# Altium schematic sheet Sheet_3.SchDoc: R2C2 - RepRapCncController
size A3; CompanyName: bitBOX; DrawnBy: FMendes75@gmail.com; Revision: V1.2; SheetNumber: 3; SheetTotal: 3; PageSetup: Record=PageOptions|CenterHorizontal=True|CenterVertical=True|PrintScale=1.04|XCorrection=1.00|YCorrection=1.00|PrintKind=1|BorderSize=5000000|LeftOffset=0|BottomOffset=0|Orientation=2|PaperLength=1000|PaperWidth=1000|Scale=100|PaperSource=7|PrintQuality=-4|MediaType=1|DitherType=10|PaperKind=A3|PrintScaleMode=1; license: Creative Commons BY-NC-SA; Site: www.3dprinting-r2c2.com; ProjectName: R2C2 - RepRapCncController
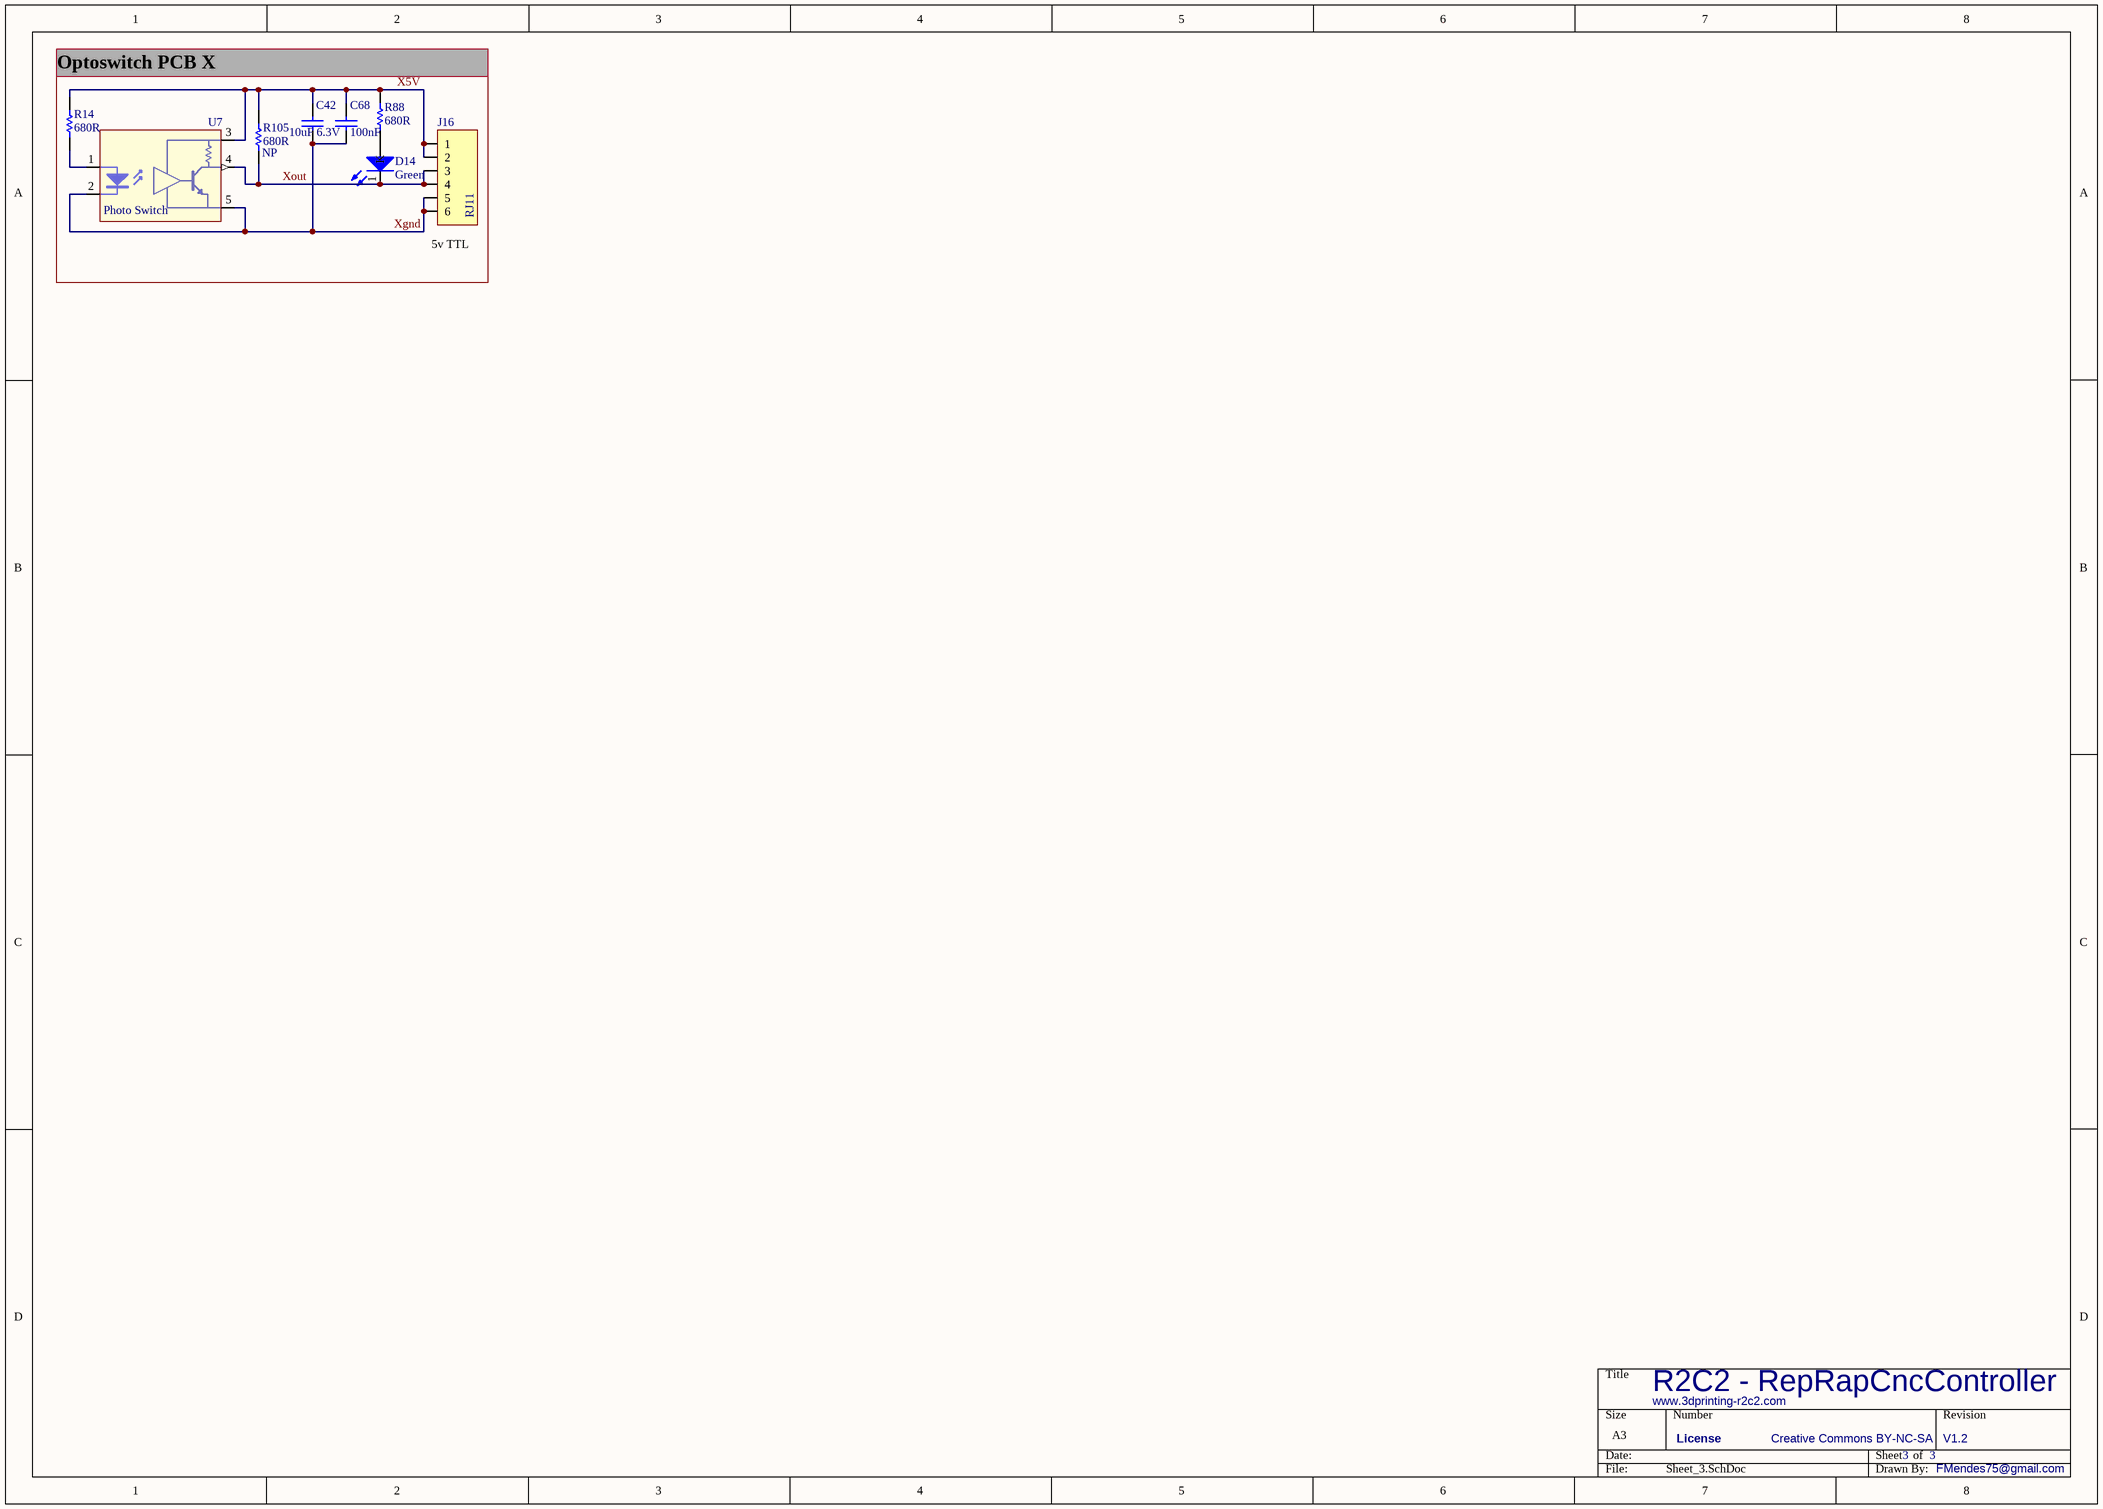
[diagram p0: Sheet_3.SchDoc]

## Parts
C42  10uF 6.3V  [CAPC2012M]
C68  100nF  [CAPC1608M]
D14  Green  [LEDM_3216X12M]
J16  RJ11  [MOLEX_95022-2667]
R14  680R  [RESC1608M]
R88  680R  [RESC1608M]
R105  680R  Populate: NP  [RESC1608M]
U7  Photo Switch  [OPIC_122x50x10]

## Nets
X5V: C42.2 C68.2 J16.1 J16.2 R14.2 R88.2 R105.2 U7.3(Vcc)
Xgnd: C42.1 C68.1 J16.5 J16.6 U7.2(K) U7.5(GND)
Xout: D14.1(K) J16.3 J16.4 R105.1 U7.4(Out)
NetD14_2: D14.2(A) R88.1
NetR14_1: R14.1 U7.1(A)

## Notes on the sheet
- Optoswitch PCB X
- (near J16) 5v TTL
- License

## Library data of the parts
C42 = 10000001: Capacitor - MLCC; 0805; Y5V; 10UF; 6.3V; Manufacturer: MULTICOMP; Type: smd; Designator: C; Man PN: MCCA000268; Pack: 0805; Distri Price1: 0,039; Distri Qty1: 100; Part Number: 10000001; Value: 10uF 6.3V; Pin Count: 2; Distri Link1: http://pt.farnell.com/multicomp/mcca000268/mlcc-08055v-6-3v-10uf/dp/1759136; Stock: 0; Component Type: Standard; Verified: 17-01-2011
C68 = 10000054: Capacitor - MLCC; 0603; NP0; 50V; Manufacturer: Multicomp; Type: smd; Designator: C; Man PN: MCCA000255; Pack: 0603; Distri Price1: 0,008; Distri Qty1: 100; Part Number: 10000054; Value: 100nF; Pin Count: 2; Distri Link1: http://pt.farnell.com/multicomp/mcca000255/mlcc-0603-x7r-50v-100nf/dp/1759122; Component Type: Standard
D14 = 10000008: Led - 1206; Green OSRAM; Type: smd; Designator: D; Man PN: LGQ971; Pack: 1206; Distri Price1: 0,063; Distri Qty1: 100; Part Number: 10000008; Manufacturer: OSRAM; Value: Green; Pin Count: 2; Distri Link1: http://pt.farnell.com/osram/lgq971/led-smd-green/dp/1226372; Stock: 0; Component Type: Standard
J16 = 10000062: Connector - PCB; RJ11; 6/4 Low Profile; Hor.; Manufacturer: Molex; Designator: J; Man PN: 95501-2641; Distri Qty1: 100; Distri Price1: 0,51; Distri Price2: 0,479; Part Number: 10000062; Type: THD; Value: RJ11; Pin Count: 6; Distri Link1: http://pt.farnell.com/molex/95501-2641/jack-6-4-low-profile/dp/1560166; Component Type: Standard; Distri Link2: http://search.digikey.com/scripts/DkSearch/dksus.dll?Detail&name=380-1018-ND; Distri Qty2: 100
R14 R88 R105 = 10000061: Resistor - 0603; 0.063W; 1%; Manufacturer: Multicomp; Designator: R; Man PN: MC 0.063W 0603 1% 680R; Pack: 0603; Distri Price1: 0,016; Distri Qty1: 100; Distri Price2: 0,006; Part Number: 10000061; Type: smd; Value: 680R; Pin Count: 2; Distri Link1: http://pt.farnell.com/multicomp/mc-0-063w-0603-5-680r/resistor-0603-680r/dp/9332251; Distri Link2: http://pt.farnell.com/multicomp/mc-0-063w-0603-5-680r/resistor-0603-680r/dp/9332251; Distri Qty2: 100; Component Type: Standard
U7 = 10000075: Opto - Switch; OPIC Sharp; Slotted 3mm; Vcc 5v; Designator: U; Man PN: GP1A53HRJ00F; Distri Price1: 1,94; Distri Qty1: 1; Part Number: 10000075; Type: THD; Manufacturer: Sharp; Value: -; Pack: -; Pin Count: 5; Distri Link1: http://pt.farnell.com/sharp/gp1a53hrj00f/photointerrupter/dp/9708006; Distri Link2: -; Distri Price2: -; Distri Qty2: -; Stock: 0; Component Type: Standard